# Altium schematic sheet AnalogSwitch.SchDoc
size A4; SheetNumber: 8; SheetTotal: 8
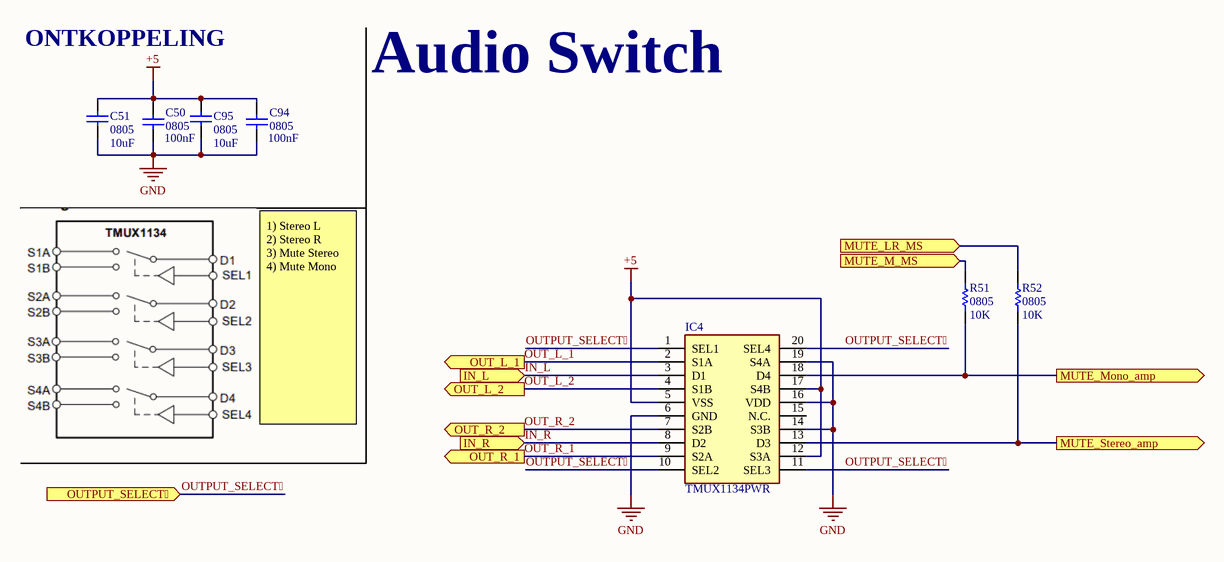
[diagram p0: AnalogSwitch.SchDoc]

## Parts
C50  0805  value 100nF  [6-0805_N]
C51  0805  value 10uF  [6-0805_N]
C94  0805  value 100nF  [6-0805_N]
C95  0805  value 10uF  [6-0805_N]
IC4  TMUX1134PWR  [SOP65P640X120-20N]
R51  0805  value 10K  [6-0805_N]
R52  0805  value 10K  [6-0805_N]

## Ports
IN_L (in, see Main[2A]), IN_R (in, see Main[2A]), MUTE_LR_MS (in, see Main[2A], FrontIO[3C]), MUTE_M_MS (in, see Main[2B], FrontIO[3D]), MUTE_Mono_amp (out, see Main[2B], TPA_MONO[1C]), MUTE_Stereo_amp (out, see Main[2B], TPA_LR[1C]), OUT_L_1 (out, see Main[2A]), OUT_L_2 (out, see Main[2B]), OUT_R_1 (out, see Main[2A]), OUT_R_2 (out, see Main[2B]), OUTPUT_SELECT (in, see Main[2B], FrontIO[3C])

## Nets
+5: C50.1 C51.1 C94.1 C95.1 IC4.5(VSS) IC4.12(S3A) IC4.17(S4B)
GND: C50.2 C51.2 C94.2 C95.2 IC4.6(GND) IC4.14(S3B) IC4.16(VDD) IC4.19(S4A)
IN_L: IC4.3(D1) ; port IN_L
IN_R: IC4.8(D2) ; port IN_R
MUTE_LR_MS: R52.2 ; port MUTE_LR_MS
MUTE_M_MS: R51.2 ; port MUTE_M_MS
MUTE_Mono_amp: IC4.18(D4) R51.1 ; port MUTE_Mono_amp
MUTE_Stereo_amp: IC4.13(D3) R52.1 ; port MUTE_Stereo_amp
OUT_L_1: IC4.2(S1A) ; port OUT_L_1
OUT_L_2: IC4.4(S1B) ; port OUT_L_2
OUT_R_1: IC4.9(S2A) ; port OUT_R_1
OUT_R_2: IC4.7(S2B) ; port OUT_R_2
OUTPUT_SELECT: IC4.1(SEL1) IC4.10(SEL2) IC4.11(SEL3) IC4.20(SEL4) ; port OUTPUT_SELECT

Not connected (* = marked no-connect by the designer): IC4 15(N.C.)

## Notes on the sheet
- ONTKOPPELING
- Audio Switch
- 1) Stereo L
  2) Stereo R
  3) Mute Stereo
  4) Mute Mono

## Library data of the parts
C50 C51 C94 C95 = Cap: Capacitor; Published: 8-Jun-2000; LatestRevisionDate: 17-Jul-2002; LatestRevisionNote: Re-released for DXP Platform.; PackageReference: RAD-0.3; Publisher: Altium Limited; PackageDescription: Radial Cap, Thru-Hole; 2 Leads; 0.3 in Pin Spacing
IC4 = TMUX1134PWR: Integrated Circuit; Manufacturer_Name: Texas Instruments; Datasheet Link: https://www.ti.com/lit/gpn/TMUX1134; Height: 1.2mm; Manufacturer_Part_Number: TMUX1134PWR; Mouser Part Number: 595-TMUX1134PWR; Mouser Price/Stock: https://www.mouser.co.uk/ProductDetail/Texas-Instruments/TMUX1134PWR?qs=%252B6g0mu59x7L8VGQncKsYmQ%3D%3D; Arrow Part Number: TMUX1134PWR; Arrow Price/Stock: https://www.arrow.com/en/products/tmux1134pwr/texas-instruments?region=nac
R51 R52 = Res1: Resistor; Published: 8-Jun-2000; LatestRevisionDate: 17-Jul-2002; LatestRevisionNote: Re-released for DXP Platform.; PackageReference: AXIAL-0.3; Publisher: Altium Limited; PackageDescription: Axial Device, Thru-Hole; 2 Leads; 0.3 in Pin Spacing